# EAGLE schematic olampki (EAGLE 7.4.0)
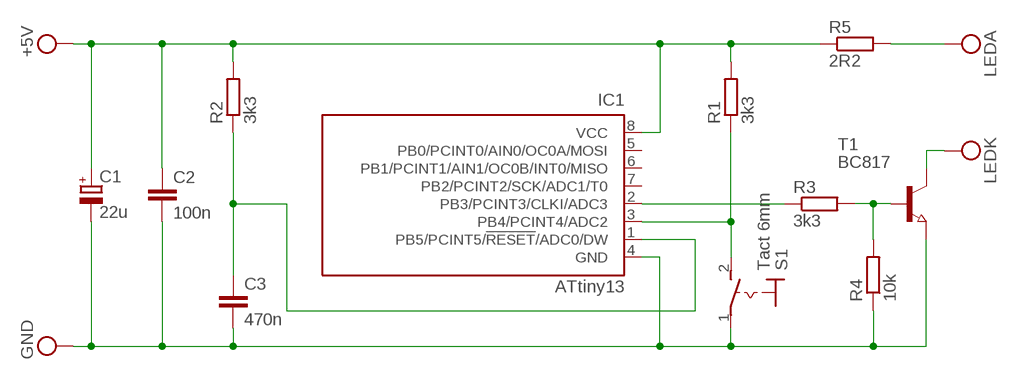
[diagram p0: schematic, sheet 1]

## Parts
C1  22u  CPOL-EU085CS-1AR  [085CS_1AR]
C2  100n  C2,5-3  [C2.5-3]
C3  470n  C2,5-3  [C2.5-3]
IC1  ATtiny13  TINY13-20SSU  [8S1]
R1  3k3  R-EU_0204/2V  [0204V]
R2  3k3  R-EU_0204/2V  [0204V]
R3  3k3  R-EU_0204/2V  [0204V]
R4  10k  R-EU_0204/2V  [0204V]
R5  2R2  R-EU_0204/2V  [0204V]
S1  Tact 6mm  MS243  [MS243]
T1  BC817  NPN-TRANSISTOR_SOT23  [SOT23]

## Nets
N$1: C3.1 IC1.1(PB5/PCINT5/!RESET!/ADC0/DW) R2.1
N$2: IC1.3(PB4/PCINT4/ADC2) R1.1 S1.2(S)
N$3: IC1.2(PB3/PCINT3/CLKI/ADC3) R3.1
N$4: R3.2 R4.2 T1.1(B)
VCC: C1.+ C1.- C2.1 C2.2 C3.2 IC1.4(GND) IC1.8(VCC) R1.2 R2.2 R4.1 R5.1 R5.2 S1.1(P) T1.2(E) T1.3(C) ; supply symbol labelled +5V, GND, LEDA, LEDK
Unconnected: IC1.5(PB0/PCINT0/AIN0/OC0A/MOSI) IC1.6(PB1/PCINT1/AIN1/OC0B/INT0/MISO) IC1.7(PB2/PCINT2/SCK/ADC1/T0)

## Library data of the parts
C1 = rcl:CPOL-EU: POLARIZED CAPACITOR, European symbol
C2 C3 = capacitor-wima:C: CAPACITOR naming: grid - package width
IC1 = atmel:TINY13: 8-bit AVR Microcontroller with 1K Bytes In-System Programmable Flash Source: http://www.atmel.com/dyn/resources/prod_documents/2535S.pdf; MPN: ATTINY13-20SSU; OC_FARNELL: 1455133; OC_NEWARK: 58M3771
R1-R5 = rcl:R-EU_: RESISTOR, European symbol
S1 = switch:MS243: TOGGLE SWITCH
T1 = semicon-smd-ipc:NPN-TRANSISTOR_: NPN TRANSISTOR